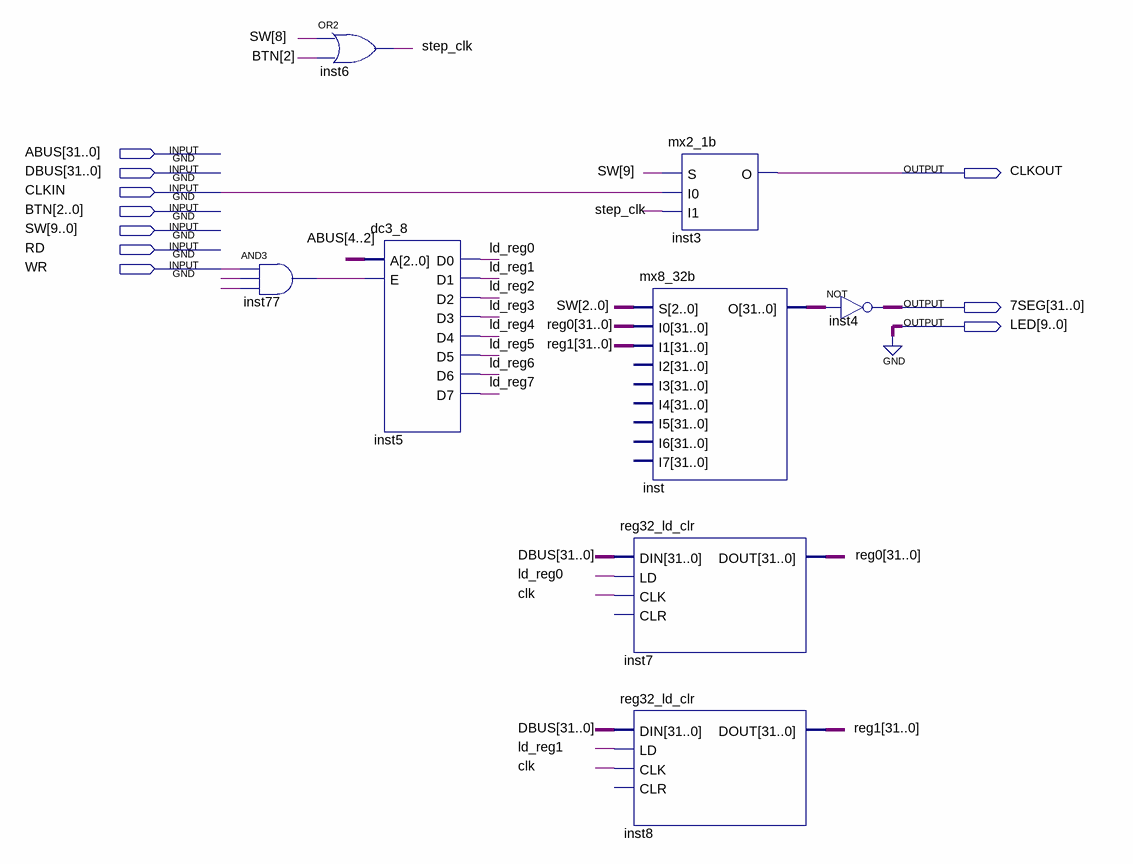
[diagram p0: schematic sheet]
// Quartus schematic dbgif.bdf as structural Verilog: 8 symbols, 10 pins
module dbgif (
  input  [31:0] ABUS,
  input  [31:0] DBUS,
  input  CLKIN,
  input  [2:0] BTN,
  input  [9:0] SW,
  input  RD,
  input  WR,
  output CLKOUT,
  output [31:0] \7SEG ,
  output [9:0] LED
);

  wire inst77_out, ld_reg0, ld_reg1, ld_reg2, ld_reg3, ld_reg4, ld_reg5, ld_reg6, ld_reg7, step_clk;
  wire [31:0] inst_o, reg0, reg1;

  and inst77 (inst77_out, WR, ABUS[16], ABUS[17]);
  or inst6 (step_clk, SW[8], BTN[2]);
  dc3_8 inst5 (
    .A(ABUS[4:2]), .E(inst77_out), .D0(ld_reg0), .D1(ld_reg1), .D2(ld_reg2), .D3(ld_reg3), .D4(ld_reg4),
    .D5(ld_reg5), .D6(ld_reg6), .D7(ld_reg7));
  mx8_32b inst (.S(SW[2:0]), .I0(reg0), .I1(reg1), .O(inst_o));  // open: I2, I3, I4, I5, I6, I7
  reg32_ld_clr inst7 (.DIN(DBUS), .LD(ld_reg0), .CLK(CLKOUT), .DOUT(reg0));  // open: CLR
  reg32_ld_clr inst8 (.DIN(DBUS), .LD(ld_reg1), .CLK(CLKOUT), .DOUT(reg1));  // open: CLR
  mx2_1b inst3 (.S(SW[9]), .I0(CLKIN), .I1(step_clk), .O(CLKOUT));
  assign \7SEG  = ~inst_o;  // NOT inst4, 32 bits wide

  assign LED = {10{1'b0}};

  // Other names for the same wires on the sheet: clk = CLKOUT
endmodule
